# EAGLE design synth-zodiac-comp-test (EAGLE 9.6.2)
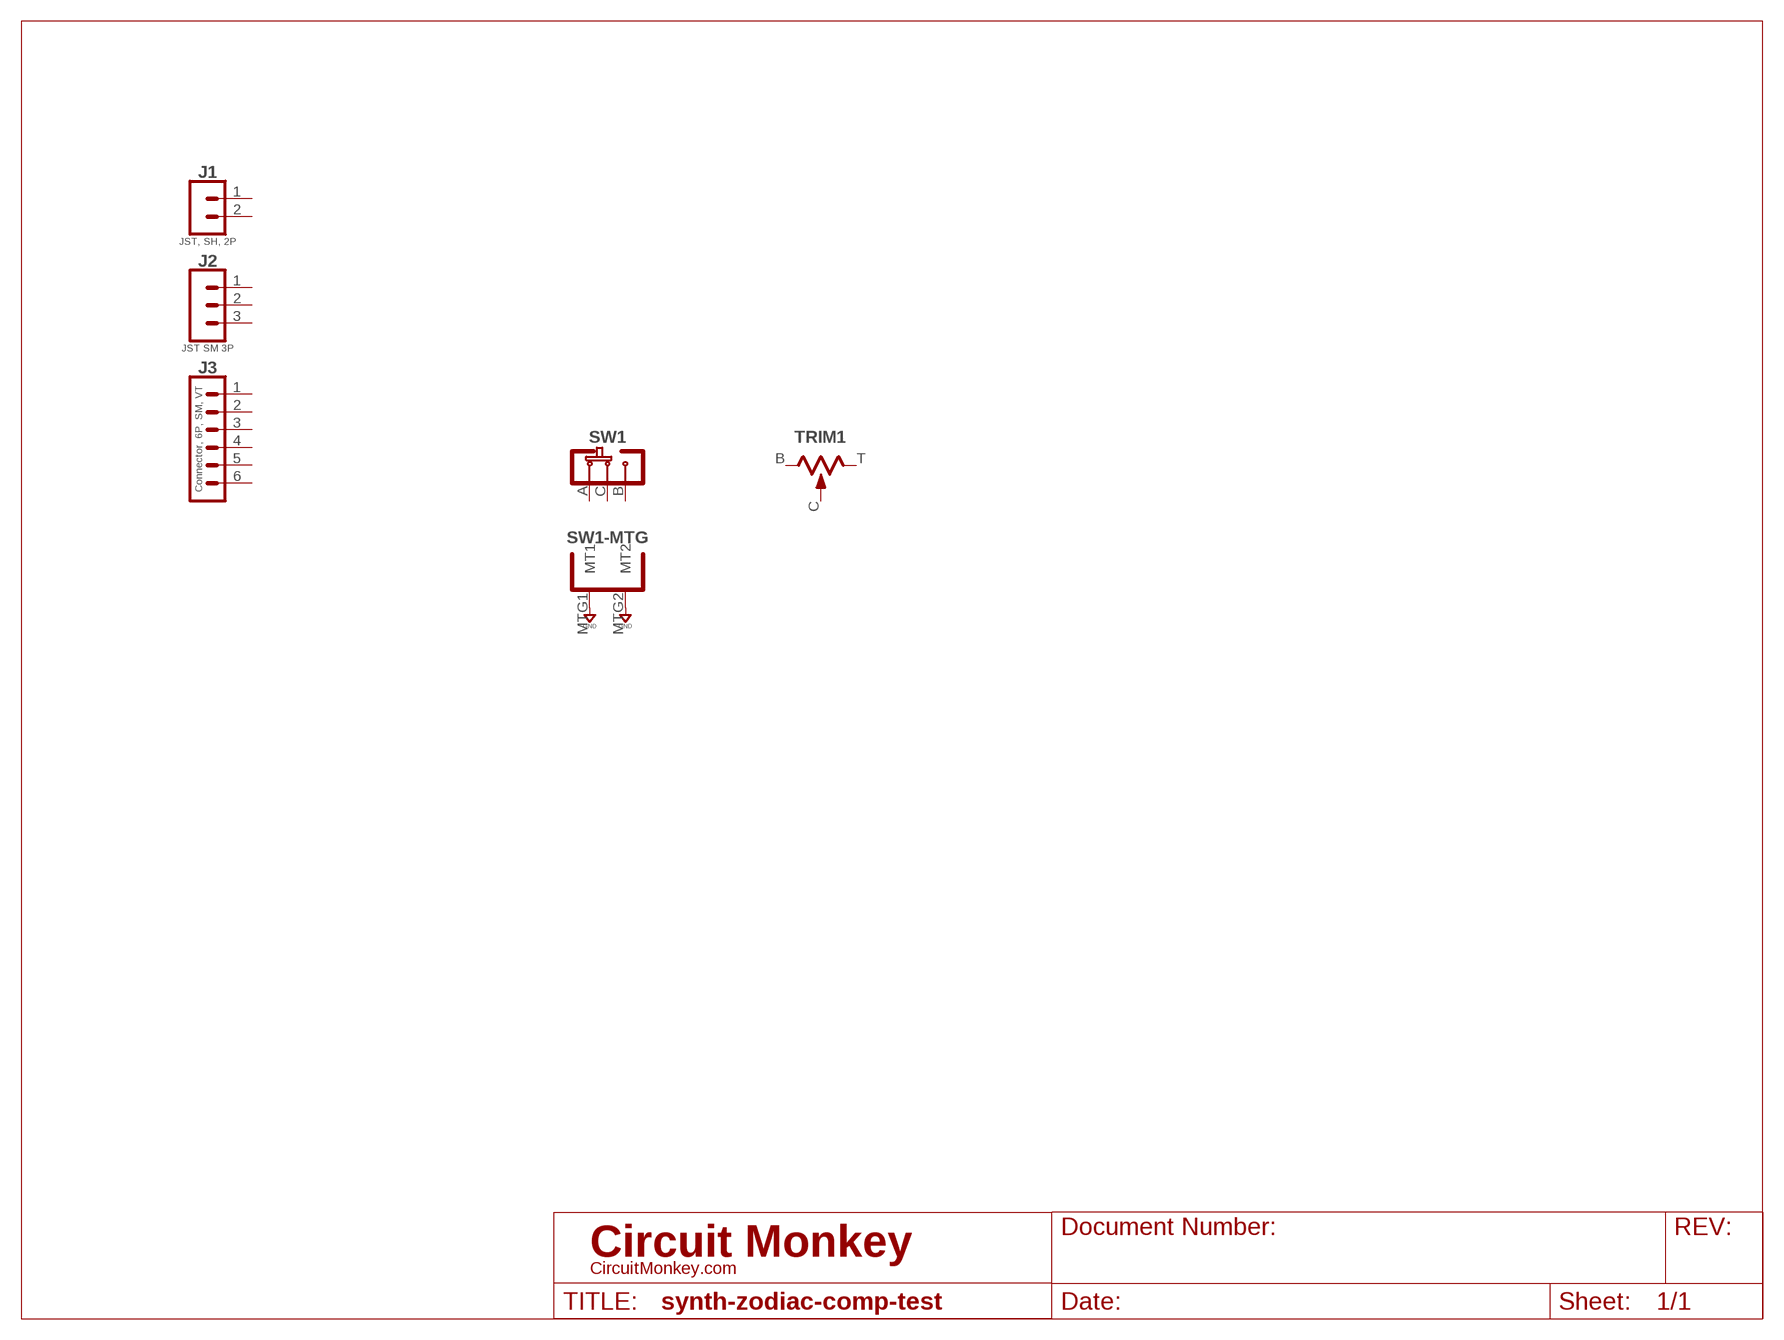
[diagram p0: schematic, sheet 1]

## Parts
J1  JST, SH, 2P  02P-SM-VT-SMT  [BM02B-SRSS-TB]
J2  JST SM 3P  03P-SM-VT-SMT  [BM03B-SRSS-TB]
J3  Connector, 6P, SM, VT  06P-SM-VT-SMT  [BM06B-SRSS-TB]
SW1  SLIDE-SPDT-MNTSS-12-F45-TH-PCB  [SS-12-F45-PNL-SMT]
TRIM1  TRIMPOT9MM_PCB_SHAFT  [POT-RV9110]

## Nets
GND: SW1.MTG1(MT1) SW1.MTG2(MT2)
Unconnected: J1.1 J1.2 J2.1 J2.2 J2.3 J3.1 J3.2 J3.3 J3.4 J3.5 J3.6 SW1.A SW1.B SW1.C TRIM1.B TRIM1.C TRIM1.T

## Library data of the parts
J1 = con-jst:02P: 2 pin connector; COST01: 0.45; COST10: 0.4; COST100: 0.35; MFR: JST; MPN: BMB02B-SRSS-TB
J2 = con-jst:03P: 3 pin connector; COST01: 0.60; COST10: 0.45; COST100: 0.38; MFR: JST; MPN: BM03B-SRSS-TB
J3 = con-jst:06P: Connector, 6P; COST01: 0.60; COST10: 0.52; COST100: 0.49; MFR: JST; MPN: BM06-SRSS-TB
SW1 = switch-thd:SLIDE-SPDT-MNT: Slide Switch, SPDT; COST01: 0.15; COST10: 0.12; COST100: 0.12; MFR: Tayda; MPN: A-659 / A-5111
TRIM1 = rlc:TRIMPOT: Potentiometer; COST01: 0.70; COST10: 0.60; COST100: 0.60; MFR: Tayda; MPN: RV9110NO-OS15A00; SKU: A-5517

## Board
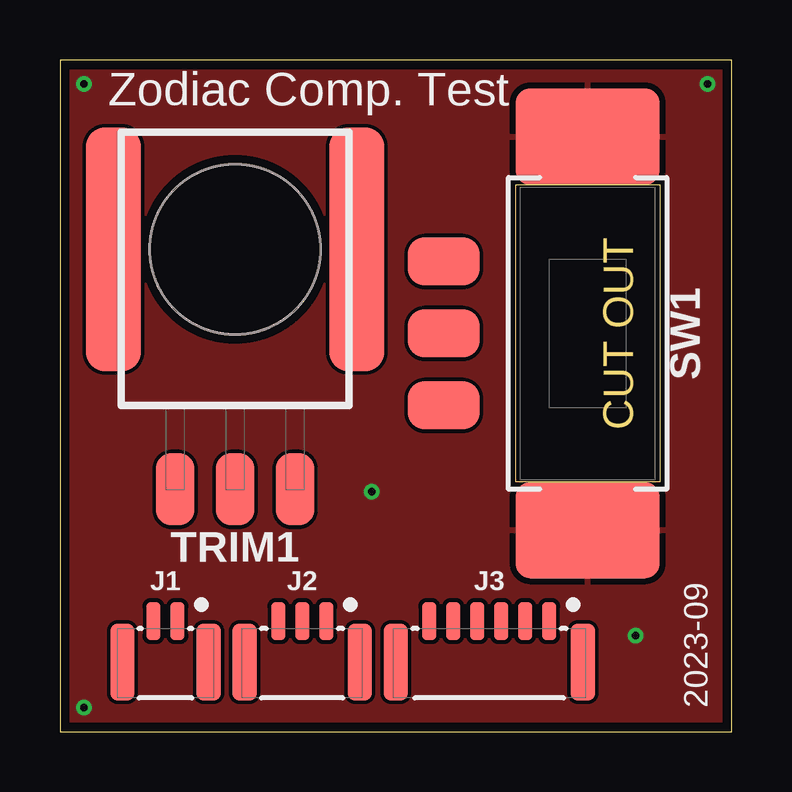
[diagram p1: board, top side]
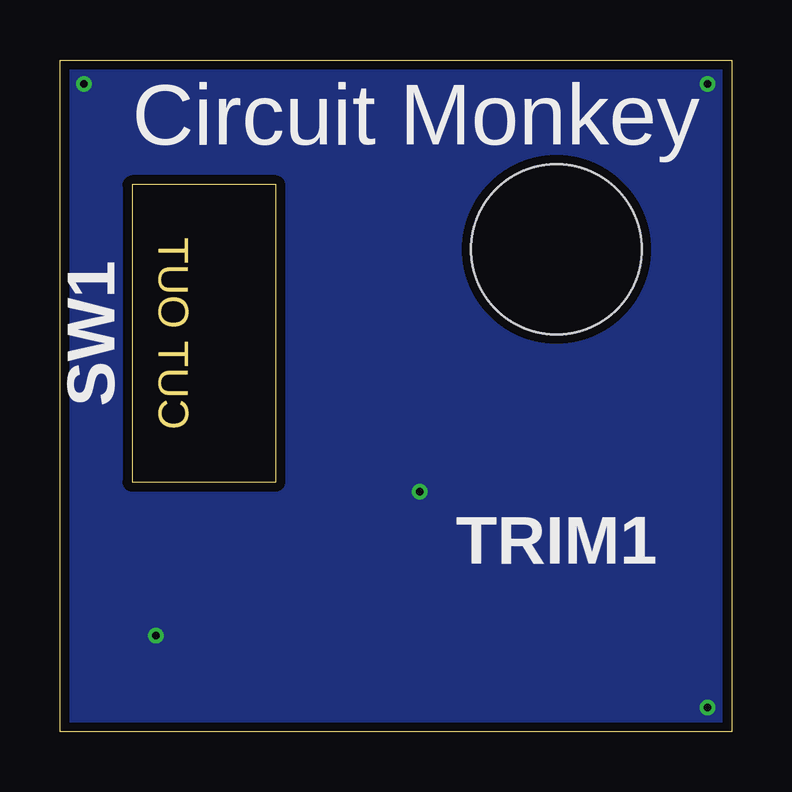
[diagram p2: board, bottom side, seen from below]

Size 28 x 28 mm. Coordinates in mm from the lower left corner, seen from the top.
Outline: 0,0 28,0 28,28 0,28 0,0
Copper layers (1*16): Top 0.0356mm / dielectric 1.5011mm / Bottom 0.0356mm
Design rules "OSH-CircuitMonkey": minimum track width 6mil, minimum drill 12mil, track to track 6mil, track to pad 6mil, pad to pad 6mil, via to via 6mil, smd to smd 6mil, copper to edge 15mil, drill to drill 6mil, minimum pad ring 7mil, minimum via ring 7mil, stop-mask expansion 3mil, vias tented up to drill 13mil, thermal gap 10mil

### Footprints (pad centres in the part's own frame; a part is rotated, then mirrored left to right if it is on the bottom)
BM02B-SRSS-TB = smd 0.6 x 1.6: 1 -0.5,-0.3; 2 0.5,-0.3 | smd 1 x 3.2: MTG1 1.8,1.4; MTG2 -1.8,1.4
BM03B-SRSS-TB = smd 0.6 x 1.6: 1 -1,-0.3; 2 0,-0.3; 3 1,-0.3 | smd 1 x 3.2: MTG1 2.4,1.4; MTG2 -2.4,1.4
BM06B-SRSS-TB = smd 0.6 x 1.6: 1 -2.5,-0.3; 2 -1.5,-0.3; 3 -0.5,-0.3; 4 0.5,-0.3; 5 1.5,-0.3; 6 2.5,-0.3 | smd 1 x 3.2: MTG1 3.9,1.4; MTG2 -3.9,1.4
SS-12-F45-PNL-SMT = smd 2 x 3: A -3,-6; B 3,-6; C 0,-6 | smd 4 x 6: MTG1 -8.2,0; MTG2 8.2,0
POT-RV9110 = smd 1.6 x 3: B 2.5,-10; C 0,-10; T -2.5,-10 | smd 2.286 x 10.16: MNT1 -5.08,0; MNT2 5.08,0 | hole 7.1: 0,0

### Placement (x,y rotation side)
J1  4.4,4.3 180 top
J2  10.1,4.3 180 top
J3  17.9,4.3 180 top
SW1  22,16.6 270 top
TRIM1  7.3,20.1 0 top

### Tracks (layer width: path | path; a pad name or v marks a point on that pad's centre or on a via)
GND  (via drill 0.3)
  other vias: 24,4 27,27 1,27 1,1 13,10
  pour Top: 0,0 0,28 28,28 28,0
  pour Bottom: 0,0 0,28 28,28 28,0

### Text on the board
tPlace: Zodiac Comp. Test | 2023-09
bPlace: Circuit Monkey